# EasyEDA Pro project ProPrj_microcontroler_2025-12-02.epro

# Schematic Schematic1
Board Name: Board1; Create Date: 2025-10-25; Page Name: P1; Project Name: microcontroler; Schematic Name: Schematic1; Update Date: 2025-10-28; Company: EasyEDA.com; Page Size: A4; Version: V1.0
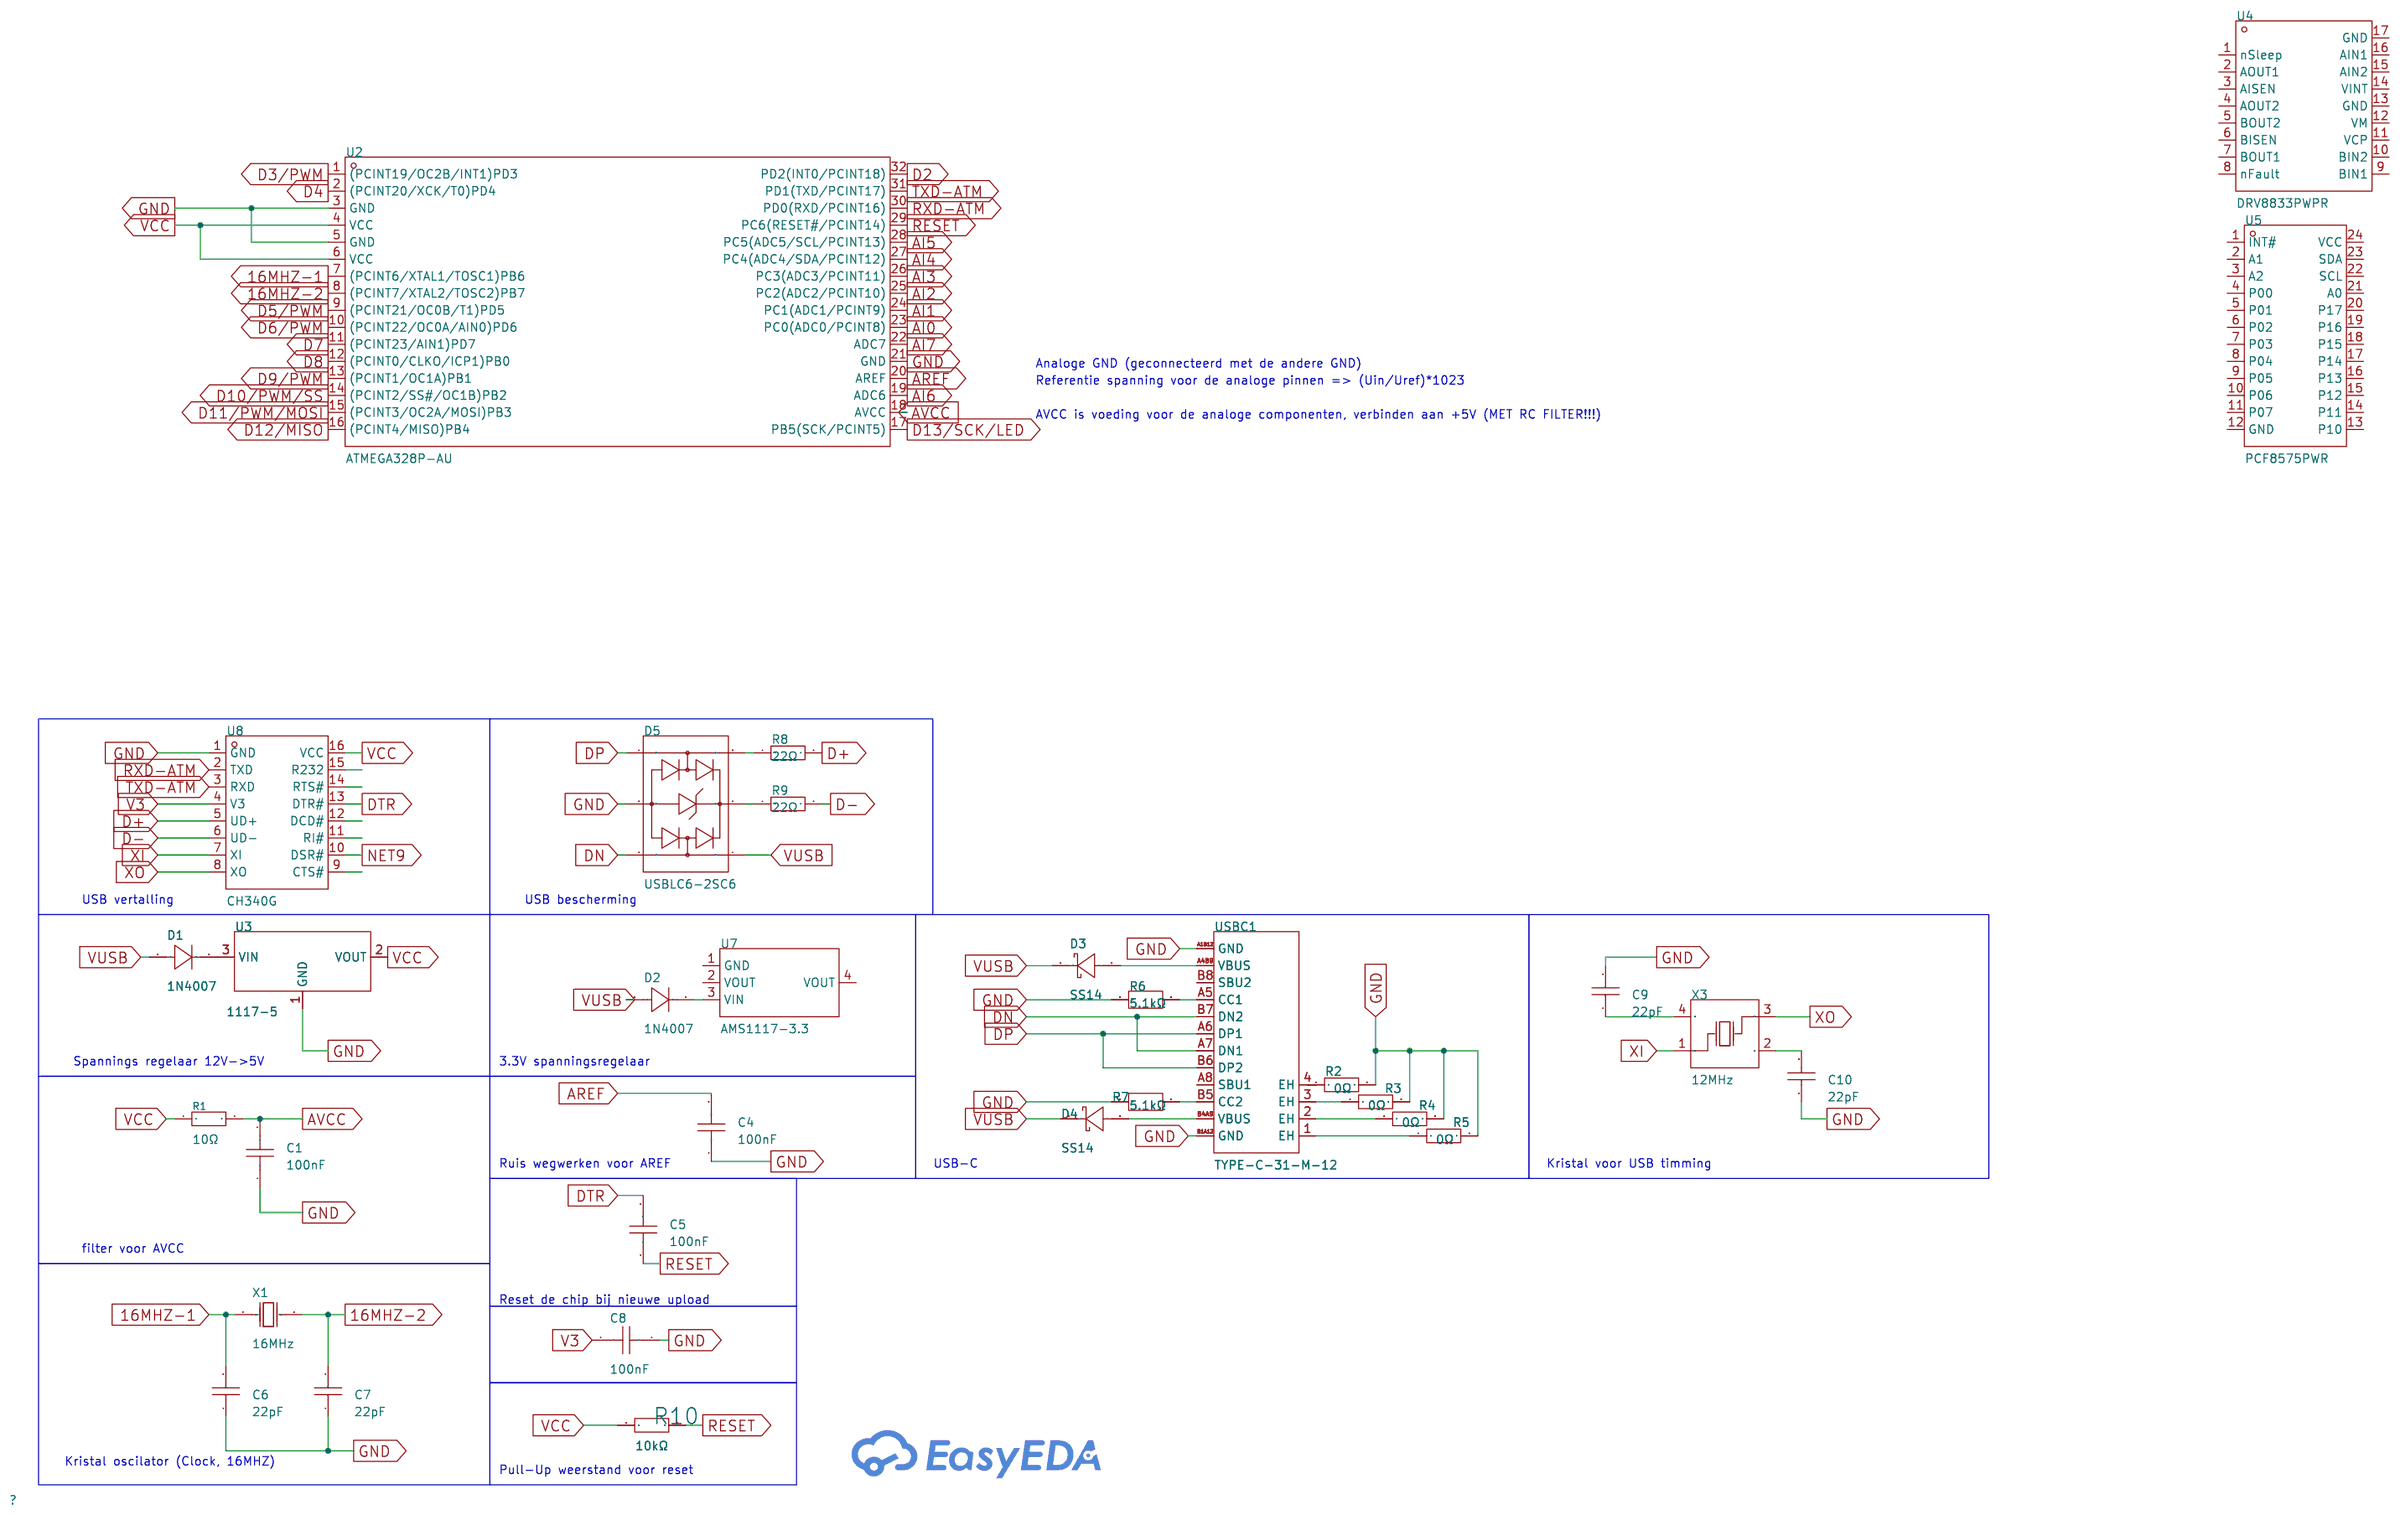
[diagram p0: schematic sheet]

## Parts
C1  100nF  [C0603]
C4  100nF  [C0603]
C5  100nF  [C0603]
C6  22pF  [C0402]
C7  22pF  [C0402]
C8  100nF  [C0603]
C9  22pF  [C0402]
C10  22pF  [C0402]
D1  1N4007  [SMA_L4.3-W2.5-LS5.0-RD]
D2  1N4007  [SMA_L4.3-W2.5-LS5.0-RD]
D3  SS14  [SMA_L4.3-W2.6-LS5.0-RD]
D4  SS14  [SMA_L4.3-W2.6-LS5.0-RD]
D5  USBLC6-2SC6  [SOT-23-6_L2.9-W1.6-P0.95-LS2.8-BL]
R1  10Ω  [R0402]
R2  0Ω  [R0603]
R3  0Ω  [R0603]
R4  0Ω  [R0603]
R5  0Ω  [R0603]
R6  5.1kΩ  [R0603]
R7  5.1kΩ  [R0603]
R8  22Ω  [R0603]
R9  22Ω  [R0603]
R10  10kΩ  [R0603]
U2  ATMEGA328P-AU  [TQFP-32_L7.0-W7.0-P0.80-LS9.0-BL]
U3  1117-5  [SOT-223-3_L6.5-W3.4-P2.30-LS7.0-BR-1]
U4  DRV8833PWPR  [TSSOP-16_L5.0-W4.4-P0.65-LS6.4-BL-EP]
U5  PCF8575PWR  [TSSOP-24_L7.8-W4.4-P0.65-LS6.4-BL]
U7  AMS1117-3.3  [SOT-223-3_L6.5-W3.4-P2.30-LS7.0-BR]
U8  CH340G  [SOIC-16_L9.9-W3.9-P1.27-LS6.0-BL]
USBC1  TYPE-C-31-M-12  [USB-C_SMD-TYPE-C-31-M-12_1]
X1  16MHz  [HC-49S_L11.4-W4.8]
X3  12MHz  [CRYSTAL-SMD_4P-L3.2-W2.5-BL]

## Library data of the parts
C1 C4 C5 C8 = CC0603KRX7R9BB104: Capacitance:100nF Tolerance:±10% Tolerance:±10% Voltage Rating:50V Temperature Coefficient:X7R; LCSC Part Name: 100nF ±10% 50V; Supplier Part: C14663; Manufacturer: YAGEO(国巨); Supplier Footprint: 0603; JLCPCB Part Class: Basic Part; Datasheet: https://item.szlcsc.com/datasheet/CC0603KRX7R9BB104/15331.html; Supplier: LCSC; Tolerance: ±10%; Voltage Rating: 50V; Temperature Coefficient: X7R
C6 C7 C9 C10 = 0402CG220J500NT: Capacitance: Tolerance:±5% Tolerance:±5% Voltage Rated: Temperature Coefficient:; LCSC Part Name: 22pF ±5% 50V; Supplier Part: C1555; Manufacturer: FH(风华); Supplier Footprint: 0402; JLCPCB Part Class: Basic Part; Datasheet: https://atta.szlcsc.com/upload/public/pdf/source/20200305/C486355_26A10D38EF8C2A5C37091D0039909270.pdf; Supplier: LCSC; Tolerance: ±5%
D1 D2 = 1N4007_C727081: Diode Configuration:Independent Voltage - Forward(Vf@If):1.1V@1A Voltage - DC Reverse(Vr):1kV Current - Rectified:1A Reverse Leakage Current (Ir):5uA; Supplier Part: C727081; Manufacturer: TWGMC(迪嘉); Supplier Footprint: SMA(DO-214AC); JLCPCB Part Class: Extended Part; Datasheet: https://item.szlcsc.com/datasheet/1N4007/774186.html; Supplier: LCSC; Diode Configuration: Independent; Voltage - Forward(Vf@If): 1.1V@1A; Voltage - DC Reverse(Vr): 1kV; Current - Rectified: 1A; Reverse Leakage Current (Ir): 5uA
D3 D4 = SS14_C47147601: Voltage - DC Reverse(Vr):40V Current - Rectified:1A Reverse Leakage Current (Ir):300uA@40V Non-Repetitive Peak Forward Surge Current:30A; LCSC Part Name: SBD肖特基二极管; Supplier Part: C47147601; Manufacturer: YONGYUTAI(永裕泰); Supplier Footprint: SMA; JLCPCB Part Class: Extended Part; Datasheet: https://item.szlcsc.com/datasheet/SS14/49348139.html; Supplier: LCSC; Voltage - DC Reverse(Vr): 40V; Current - Rectified: 1A; Reverse Leakage Current (Ir): 300uA@40V; Non-Repetitive Peak Forward Surge Current: 30A
D5 = USBLC6-2SC6_C21713975: Polarity:Unidirectional Reverse Stand-Off Voltage (Vrwm):5V Clamping Voltage:14V Peak Pulse Current (Ipp):4.5A@8/20us Peak Pulse Power Dissipation (Ppp):60W@8/20us Voltage - Breakdown:6V Reverse Leakage Current (Ir):500nA Number of Channels:2 Operating Te; LCSC Part Name: 丝印UL26 单向 5V截止 4.5A峰值脉冲; Supplier Part: C21713975; Manufacturer: GOODWORK(固得沃克); Supplier Footprint: SOT-23-6; JLCPCB Part Class: Extended Part; Datasheet: https://item.szlcsc.com/datasheet/USBLC6-2SC6/23140168.html; Supplier: LCSC; Polarity: Unidirectional; Reverse Stand-Off Voltage (Vrwm): 5V; Clamping Voltage: 14V; Peak Pulse Current (Ipp): 4.5A@8/20us; Peak Pulse Power Dissipation (Ppp): 60W@8/20us; Voltage - Breakdown: 6V; Reverse Leakage Current (Ir): 500nA; Number of Channels: 2; Operating Temperature: -55℃~+125℃; level of protection: IEC 61000-4-5；IEC 61000-4-2; Type: TVS; Junction Capacitance: 0.6pF
R1 = 0402WGF100JTCE: Type:Thick Film Resistor Resistance:10Ω Tolerance:±1% Tolerance:±1% Power(Watts):62.5mW Voltage-Supply(Max):50V Temperature Coefficient:±200ppm/℃ Temperature Coefficient:±200ppm/℃ Operating Temperature:-55℃~+155℃ Operating Temperature:-55℃~+155℃; LCSC Part Name: 10Ω ±1% 62.5mW 厚膜电阻; Supplier Part: C25077; Manufacturer: UNI-ROYAL(厚声); Supplier Footprint: 0402; JLCPCB Part Class: Basic Part; Datasheet: https://item.szlcsc.com/datasheet/0402WGF100JTCE/25820.html; Supplier: LCSC; Type: Thick Film Resistor; Tolerance: ±1%; Power(Watts): 62.5mW; Voltage-Supply(Max): 50V; Temperature Coefficient: ±200ppm/℃; Operating Temperature: -55℃~+155℃
R2-R5 = 0603WAF0000T5E: Type:Thick Film Resistor Resistance:0Ω Tolerance:±1% Tolerance:±1% Power(Watts):100mW Voltage-Supply(Max):75V Temperature Coefficient:- Temperature Coefficient:- Operating Temperature:-55℃~+155℃ Operating Temperature:-55℃~+155℃; LCSC Part Name: 0Ω ±1% 100mW 厚膜电阻; Supplier Part: C21189; Manufacturer: UNI-ROYAL(厚声); Supplier Footprint: 0603; JLCPCB Part Class: Basic Part; Datasheet: https://item.szlcsc.com/datasheet/0603WAF0000T5E/21903.html; Supplier: LCSC; Type: Thick Film Resistor; Tolerance: ±1%; Power(Watts): 100mW; Voltage-Supply(Max): 75V; Operating Temperature: -55℃~+155℃
R6 R7 = FRC0603F5101TS: Type:Thick Film Resistor Resistance:5.1kΩ Tolerance:±1% Tolerance:±1% Power(Watts):100mW Voltage-Supply(Max):75V Temperature Coefficient:±100ppm/℃ Temperature Coefficient:±100ppm/℃ Operating Temperature:-55℃~+155℃ Operating Temperature:-55℃~+155℃; LCSC Part Name: 5.1kΩ ±1% 100mW 厚膜电阻; Supplier Part: C2907044; Manufacturer: FOJAN(富捷); Supplier Footprint: 0603; JLCPCB Part Class: Extended Part; Supplier: LCSC; Type: Thick Film Resistor; Tolerance: ±1%; Power(Watts): 100mW; Voltage-Supply(Max): 75V; Temperature Coefficient: ±100ppm/℃; Operating Temperature: -55℃~+155℃
R8 R9 = 0603WAF220JT5E: Type:Thick Film Resistors Resistance:22Ω Tolerance:±1% Tolerance:±1% Power(Watts): Overload Voltage (Max): Temperature Coefficient:±100ppm/℃ Temperature Coefficient:±100ppm/℃ Operating Temperature Range:-55℃~+155℃ Operating Temperature Range:-55℃~+155℃; LCSC Part Name: 22Ω ±1% 100mW 厚膜电阻; Supplier Part: C23345; Manufacturer: UNI-ROYAL(厚声); Supplier Footprint: 0603; JLCPCB Part Class: Basic Part; Datasheet: https://atta.szlcsc.com/upload/public/pdf/source/20200306/C422600_1E6D84923E4A46A82E41ADD87F860B5C.pdf; Supplier: LCSC; Type: Thick Film Resistors; Tolerance: ±1%; Temperature Coefficient: ±100ppm/℃; Operating Temperature Range: -55℃~+155℃
R10 = 0603WAF1002T5E: Type:Thick Film Resistor Resistance:10kΩ Tolerance:±1% Tolerance:±1% Power(Watts):100mW Voltage-Supply(Max):75V Temperature Coefficient:±100ppm/℃ Temperature Coefficient:±100ppm/℃ Operating Temperature:-55℃~+155℃ Operating Temperature:-55℃~+155℃; LCSC Part Name: 厚膜电阻 10kΩ ±1% 100mW; Supplier Part: C25804; Manufacturer: UNI-ROYAL(厚声); Supplier Footprint: 0603; JLCPCB Part Class: Basic Part; Datasheet: https://item.szlcsc.com/datasheet/0603WAF1002T5E/26547.html; Supplier: LCSC; Type: Thick Film Resistor; Tolerance: ±1%; Power(Watts): 100mW; Voltage-Supply(Max): 75V; Temperature Coefficient: ±100ppm/℃; Operating Temperature: -55℃~+155℃
U2 = ATMEGA328P-AU_C14877: CPU Core:AVR CPU Maximum Speed:20MHz Program Storage Size:32KB Program Memory Type:FLASH EEPROM:1KB Number of I/O:23 ADC (Bit):10bit Voltage - Supply:1.8V~5.5V Voltage - Supply:1.8V~5.5V Applications:-; LCSC Part Name: 基于AVR增强型RISC架构的低功耗CMOS 8位微控制器; Supplier Part: C14877; Manufacturer: MICROCHIP(美国微芯); Supplier Footprint: TQFP-32(7x7); JLCPCB Part Class: Extended Part; Datasheet: https://item.szlcsc.com/datasheet/ATMEGA328P-AU/15549.html; Supplier: LCSC; CPU Core: AVR; CPU Maximum Speed: 20MHz; Program Storage Size: 32KB; Program Memory Type: FLASH; EEPROM: 1KB; Number of I/O: 23; ADC (Bit): 10bit; Voltage - Supply: 1.8V~5.5V
U3 = 1117-5: Output Type:Fixed Voltage - Supply:12V Output Voltage:5V Output Voltage:5V Output Current:1A Power Supply Rejection Ratio (PSRR):75dB@(120Hz) Voltage Dropout:1.3V@(1A) standby current:10mA Noise:0.003%Vout Features:Over Temperature Protection；Over Current; LCSC Part Name: 三端稳压器; Supplier Part: C5125089; Manufacturer: IDCHIP(英锐芯); Supplier Footprint: SOT-223; JLCPCB Part Class: Extended Part; Datasheet: https://item.szlcsc.com/datasheet/1117-5/5722230.html; Supplier: LCSC; Output Type: Fixed; Voltage - Supply: 12V; Output Voltage: 5V; Output Current: 1A; Power Supply Rejection Ratio (PSRR): 75dB@(120Hz); Voltage Dropout: 1.3V@(1A); standby current: 10mA; Noise: 0.003%Vout; Features: Over Temperature Protection；Over Current Protection; Operating Temperature: -40℃~+125℃@(Tj); Output Configuration: Positive; Number of Outputs: 1
U4 = DRV8833PWPR: Technology:Yes Operating Temperature:-40℃~+85℃ Operating Temperature:-40℃~+85℃; LCSC Part Name: 1.5A 有刷直流电机驱动芯片 10.8V; Supplier Part: C50506; Manufacturer: TI(德州仪器); Supplier Footprint: TSSOP-16-EP; JLCPCB Part Class: Extended Part; Datasheet: https://www.ti.com/cn/lit/gpn/drv8833; Supplier: LCSC; Technology: Yes; Operating Temperature: -40℃~+85℃
U5 = PCF8575PWR: Interface:I2C；SMBus Number of I/O:16 Interrupt Output:Interrupt Output Output Type:- Voltage - Supply:2.5V~5.5V Voltage - Supply:2.5V~5.5V Current - Output Low(IOL):- Current - Output High(IOH):- Clock Frequency:400kHz Operating Temperature:-40℃~+85℃ Oper; LCSC Part Name: 具有中断输出的PCF8575远程16位I²C和 SMBuS I/O扩展器; Supplier Part: C2652277; Manufacturer: TI(德州仪器); Supplier Footprint: TSSOP-24; JLCPCB Part Class: Extended Part; Datasheet: https://www.ti.com/cn/lit/gpn/pcf8575; Supplier: LCSC; Interface: I2C；SMBus; Number of I/O: 16; Interrupt Output: Interrupt Output; Voltage - Supply: 2.5V~5.5V; Clock Frequency: 400kHz; Operating Temperature: -40℃~+85℃
U7 = AMS1117-3.3_C6186: Output Type:Fixed Voltage - Supply:16V Output Voltage:3.3V Output Voltage:3.3V Output Current:1A Power Supply Rejection Ratio (PSRR):72dB@(120Hz) Voltage Dropout:1.1V@(800mA) standby current:5mA Noise:0.003%Vout Features:Over Current Protection；Over Tempe; LCSC Part Name: 输出3.3V 1A; Supplier Part: C6186; Manufacturer: AMS; Supplier Footprint: SOT-223; JLCPCB Part Class: Basic Part; Datasheet: https://item.szlcsc.com/datasheet/AMS1117-3.3/6652.html; Supplier: LCSC; Output Type: Fixed; Voltage - Supply: 16V; Output Voltage: 3.3V; Output Current: 1A; Power Supply Rejection Ratio (PSRR): 72dB@(120Hz); Voltage Dropout: 1.1V@(800mA); standby current: 5mA; Noise: 0.003%Vout; Features: Over Current Protection；Over Temperature Protection; Operating Temperature: -40℃~+125℃; Output Configuration: Positive; Number of Outputs: 1
U8 = CH340G: Applications Function:USB to UART Protocol: Supply Voltage:5V；3.3V Supply Voltage:5V；3.3V Data Rate:2Mbps Operating Temperature:-40℃~+85℃ Operating Temperature:-40℃~+85℃; LCSC Part Name: USB转串口芯片CH340; Supplier Part: C14267; Manufacturer: WCH(南京沁恒); Supplier Footprint: SOP-16; JLCPCB Part Class: Extended Part; Datasheet: https://atta.szlcsc.com/upload/public/pdf/source/20240313/8510303D24D987FBF1AD30058571F10E.pdf; Supplier: LCSC; Applications Function: USB to UART; Supply Voltage: 5V；3.3V; Data Rate: 2Mbps; Operating Temperature: -40℃~+85℃
USBC1 = TYPE-C-31-M-12: Connector Type:Type-C Protocol Standard:- Gender:Female Mounting Type:- Number of Contacts:16P Number of Ports:1 Current Rating-Power:5A Operating Temperature:- Operating Temperature:-; LCSC Part Name: Type-C 母; Supplier Part: C165948; Manufacturer: 韩国韩荣; Supplier Footprint: SMD; JLCPCB Part Class: Extended Part; Datasheet: https://item.szlcsc.com/datasheet/TYPE-C-31-M-12/177331.html; Supplier: LCSC; Connector Type: Type-C; Gender: Female; Number of Contacts: 16P; Number of Ports: 1; Current Rating-Power: 5A
X1 = X49SM16MSD2SC: Type:Crystal Oscillator Frequency:16MHz Normal temperature Frequency Tolerance:±20ppm Normal temperature Frequency Tolerance:±20ppm Load Capacitance:20pF Frequency Stability:±30ppm Frequency Stability:±30ppm Operating Temperature:-20℃~+70℃ Operating Tempe; LCSC Part Name: HC-49SMD 16MHZ 2P 49SMD 20PF ±20PPM -20~70℃（±30PPM）; Supplier Part: C12676; Manufacturer: YXC(扬兴晶振); Supplier Footprint: HC-49S-SMD; JLCPCB Part Class: Extended Part; Datasheet: https://item.szlcsc.com/datasheet/X49SM16MSD2SC/13312.html; Supplier: LCSC; Type: Crystal Oscillator; Normal temperature Frequency Tolerance: ±20ppm; Load Capacitance: 20pF; Frequency Stability: ±30ppm; Operating Temperature: -20℃~+70℃
X3 = X322512MSB4SI: Type:Surface Mount Crystal Frequency:12MHz Normal temperature Frequency Tolerance:±10ppm Normal temperature Frequency Tolerance:±10ppm Load Capacitance:20pF Frequency Stability:±20ppm Frequency Stability:±20ppm Operating Temperature:-40℃~+85℃ Operating Te; LCSC Part Name: YSX321SL 12MHZ 4P 3225 20PF ±10PPM -40~85℃ (±20PPM); Supplier Part: C9002; Manufacturer: YXC(扬兴晶振); Supplier Footprint: SMD3225-4P; JLCPCB Part Class: Basic Part; Datasheet: https://item.szlcsc.com/datasheet/X322512MSB4SI/9522.html; Supplier: LCSC; Type: Surface Mount Crystal; Normal temperature Frequency Tolerance: ±10ppm; Load Capacitance: 20pF; Frequency Stability: ±20ppm; Operating Temperature: -40℃~+85℃

## Nets
AVCC: C1.2 R1.2 U2.18(AVCC)
GND: C1.1 C4.1 C6.1 C7.1 C8.1 C9.2 C10.1 D5.2(GND) R2.2 R3.2 R4.2 R5.2 R6.1 R7.1 U2.3(GND) U2.5(GND) U2.21(GND) U3.1(GND) U8.1(GND) USBC1.A1B12(GND) USBC1.B1A12(GND)
V3: C8.2 U8.4(V3)
VCC: R1.1 R10.1 U2.4(VCC) U2.6(VCC) U3.2(VOUT) U8.16(VCC)
16MHZ-1: C6.2 U2.7((PCINT6/XTAL1/TOSC1)PB6) X1.1(OSC1)
16MHZ-2: C7.2 U2.8((PCINT7/XTAL2/TOSC2)PB7) X1.2(OSC2)
AI0: U2.23(PC0(ADC0/PCINT8))
AI1: U2.24(PC1(ADC1/PCINT9))
AI2: U2.25(PC2(ADC2/PCINT10))
AI3: U2.26(PC3(ADC3/PCINT11))
AI4: U2.27(PC4(ADC4/SDA/PCINT12))
AI5: U2.28(PC5(ADC5/SCL/PCINT13))
AI6: U2.19(ADC6)
AI7: U2.22(ADC7)
AREF: C4.2 U2.20(AREF)
D2: U2.32(PD2(INT0/PCINT18))
D3/PWM: U2.1((PCINT19/OC2B/INT1)PD3)
D4: U2.2((PCINT20/XCK/T0)PD4)
D5/PWM: U2.9((PCINT21/OC0B/T1)PD5)
D6/PWM: U2.10((PCINT22/OC0A/AIN0)PD6)
D7: U2.11((PCINT23/AIN1)PD7)
D8: U2.12((PCINT0/CLKO/ICP1)PB0)
D9/PWM: U2.13((PCINT1/OC1A)PB1)
D10/PWM/SS: U2.14((PCINT2/SS#/OC1B)PB2)
D11/PWM/MOSI: U2.15((PCINT3/OC2A/MOSI)PB3)
D12/MISO: U2.16((PCINT4/MISO)PB4)
D13/SCK/LED: U2.17(PB5(SCK/PCINT5))
D+: R8.2 U8.5(UD+)
D-: R9.2 U8.6(UD-)
DN: D5.3(I/O2) USBC1.A7(DN1) USBC1.B7(DN2)
DP: D5.1(I/O1) USBC1.A6(DP1) USBC1.B6(DP2)
DTR: C5.2 U8.13(DTR#)
NET9: U8.10(DSR#)
RESET: C5.1 R10.2 U2.29(PC6(RESET#/PCINT14))
RXD-ATM: U2.30(PD0(RXD/PCINT16)) U8.2(TXD)
TXD-ATM: U2.31(PD1(TXD/PCINT17)) U8.3(RXD)
VUSB: D1.2(A) D2.2(A) D3.1(C) D4.1(C) D5.4(I/O2)
XI: U8.7(XI) X3.1(OSC1)
XO: U8.8(XO) X3.3(OSC2)
Net-(C9-1): C9.1 X3.4(GND)
Net-(C10-2): C10.2 X3.2(GND)
Net-(D1-1): D1.1(K) U3.3(VIN)
Net-(D2-1): D2.1(K) U7.3(VIN)
Net-(D3-2): D3.2(A) USBC1.A4B9(VBUS)
Net-(D4-2): D4.2(A) USBC1.B4A9(VBUS)
Net-(D5-5): D5.5(VBUS) R9.1
Net-(D5-6): D5.6(I/O1) R8.1
Net-(R2-1): R2.1 USBC1.4(EH)
Net-(R3-1): R3.1 USBC1.3(EH)
Net-(R4-1): R4.1 USBC1.2(EH)
Net-(R5-1): R5.1 USBC1.1(EH)
Net-(R6-2): R6.2 USBC1.A5(CC1)
Net-(R7-2): R7.2 USBC1.B5(CC2)

Not connected (* = marked no-connect by the designer): U4 1(nSleep) 2(AOUT1) 3(AISEN) 4(AOUT2) 5(BOUT2) 6(BISEN) 7(BOUT1) 8(nFault) 9(BIN1) 10(BIN2) 11(VCP) 12(VM) 13(GND) 14(VINT) 15(AIN2) 16(AIN1) 17(GND); U5 1(INT#) 2(A1) 3(A2) 4(P00) 5(P01) 6(P02) 7(P03) 8(P04) 9(P05) 10(P06) 11(P07) 12(GND) 13(P10) 14(P11) 15(P12) 16(P13) 17(P14) 18(P15) 19(P16) 20(P17) 21(A0) 22(SCL) 23(SDA) 24(VCC); U7 1(GND) 2(VOUT) 4(VOUT); U8 9(CTS#) 11(RI#) 12(DCD#) 14(RTS#) 15(R232); USBC1 A8(SBU1) B8(SBU2)

## Notes on the sheet
- Analoge GND (geconnecteerd met de andere GND)
- Referentie spanning voor de analoge pinnen => (Uin/Uref)*1023
- AVCC is voeding voor de analoge componenten, verbinden aan +5V (MET RC FILTER!!!)
- USB vertalling
- USB bescherming
- Spannings regelaar 12V->5V
- 3.3V spanningsregelaar
- Ruis wegwerken voor AREF
- USB-C
- Kristal voor USB timming
- filter voor AVCC
- Reset de chip bij nieuwe upload
- Kristal oscilator (Clock, 16MHZ)
- Pull-Up weerstand voor reset
